# Altium project PaneLED.PrjPCB
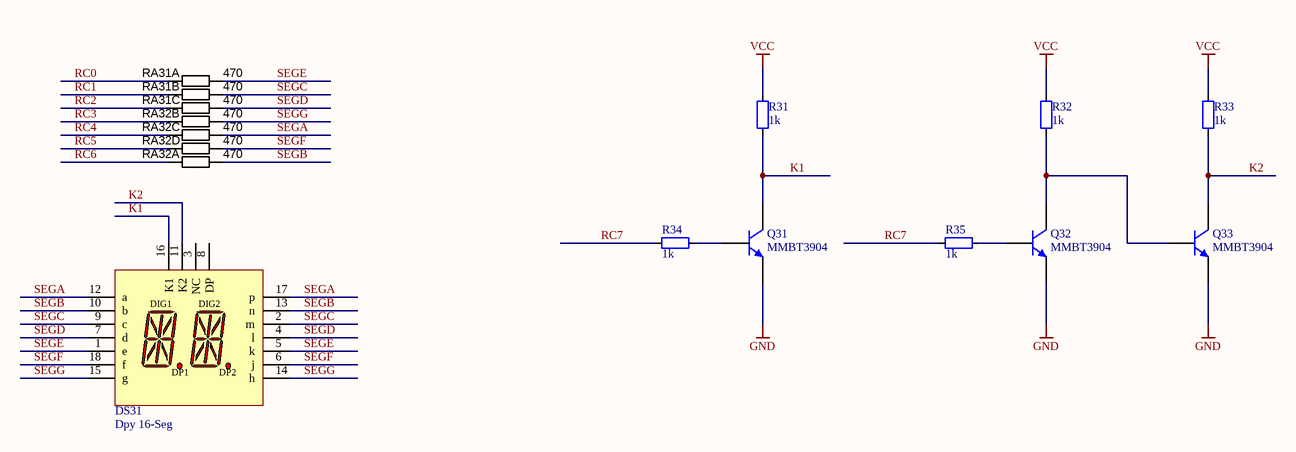
[diagram p0: 3 - display.SchDoc]
1 sheet, 11 parts. Net scope: global (net labels, ports and power ports of the same name join across sheets).
Board file: main.PcbDoc

## Sheet 3 - display.SchDoc
size A4

### Parts
DS31  Dpy 16-Seg  [HDSP-A2]
Q31  MMBT3904  [SOT23_N]
Q32  MMBT3904  [SOT23_N]
Q33  MMBT3904  [SOT23_N]
R31  value 1k  [RES_0603]  (hidden comment: Res_0603)
R32  value 1k  [RES_0603]  (hidden comment: Res_0603)
R33  value 1k  [RES_0603]  (hidden comment: Res_0603)
R34  value 1k  [RES_0603]  (hidden comment: Res_0603)
R35  value 1k  [RES_0603]  (hidden comment: Res_0603)
RA31  value 470  [RESCAXS50P160X320X70-8N]  (hidden comment: Film Res Pack)  (parts A,B,C of 4)
RA32  value 470  [RESCAXS50P160X320X70-8N]  (hidden comment: Film Res Pack)  (parts A,B,C,D of 4)

### Nets
GND: Q31.2(E) Q32.2(E) Q33.2(E)
VCC: R31.2 R32.2 R33.2
K1: DS31.16(K1) Q31.3(C) R31.1
K2: DS31.11(K2) Q33.3(C) R33.1
RC0: RA31.1
RC1: RA31.2
RC2: RA31.3
RC3: RA32.2
RC4: RA32.3
RC5: RA32.4
RC6: RA32.1
RC7: R34.2 R35.2
SEGA: DS31.12(a) DS31.17(p) RA32.6
SEGB: DS31.10(b) DS31.13(n) RA32.8
SEGC: DS31.2(m) DS31.9(c) RA31.7
SEGD: DS31.4(l) DS31.7(d) RA31.6
SEGE: DS31.1(e) DS31.5(k) RA31.8
SEGF: DS31.6(j) DS31.18(f) RA32.5
SEGG: DS31.14(h) DS31.15(g) RA32.7
NetQ31_1: Q31.1(B) R34.1
NetQ32_1: Q32.1(B) R35.1
NetQ32_3: Q32.3(C) Q33.1(B) R32.1

Not connected (* = marked no-connect by the designer): DS31 3(NC) 8(DP)

### Notes on the sheet
- (in symbol Dpy 16-Seg) DIG1; DIG2; DP1; DP2

### Library data of the parts
DS31 = Dpy 16-Seg: 13.7 mm Gray Surface As AlInGaP Red Alphanumeric Display: 2-Character, CC; Published: 8-Jun-2000; LatestRevisionDate: 17-Dec-2003; LatestRevisionNote: Schematic revised, PCB Footprint replaced.; DatasheetVersion: 20-Nov-2001; PackageVersion: 20-Nov-2001; PackageReference: HDSP-A2; Publisher: Altium Limited; PackageDescription: LED, Alphanumeric Display, 13.8 mm, Dual Character; 18 Leads; Row Space 15.24 mm; Pitch 2.54 mm; Colour: As AlInGaP Red; ComponentLink1Description: Manufacturer Link; ComponentLink1URL: http://www.agilent.com/
Q31-Q33 = MMBT3904: NPN Switching Transistor; Published: 17-Sep-2003; LatestRevisionDate: 12-Dec-2006; LatestRevisionNote: IPC-7351 Footprint Added.; DatasheetVersion: 13-May-2002; PackageVersion: May-1999; PackageReference: SOT23; Publisher: Altium Limited; PackageDescription: 3-Pin SOT-23 Package 0.95 mm Pitch, 2.3 mm Lead Span; ComponentLink1Description: Manufacturer Link; ComponentLink1URL: http://www.semiconductors.philips.com/; ComponentLink2Description: Datasheet; ComponentLink2URL: http://www.semiconductors.philips.com/acrobat/datasheets/MMBT3904_4.pdf; Supplier Part Number 1: MMBT3904FSCT-ND; Supplier 1: Digi-Key
R31-R35 = Res_0603: Resistor
RA31 RA32 = RESPACK_1K_5%_4X: Resistor array 1K Ohm 4-pack 62.5mW 5% 4x1608 SMD; Manufacturer 1: Yageo; Manufacturer Part Number 1: YC164-JR-071KL; Ratings: 1/16 W; Number of Resistors: 4; Circuit Type: Isolated; SCDType: source; Package / Case: 1206 (3216 Metric), Convex; Tolerance: ±5%; Number of Pins: 8; Power Per Element: 62.5mW; Mounting Type: Surface Mount; Supplier Device Package: 4 x 0603; Operating Temperature: -55°C ~ 155°C; ComponentLink1URL: http://www.yageo.com/documents/recent/PYu-YC_TC164_51_RoHS_L_3.pdf; ComponentLink1Description: http://www.yageo.com/documents/recent/PYu-YC_TC164_51_RoHS_L_3.pdf; Supplier 1: Digi-Key; Supplier Part Number 1: YC164J-1.0KCT-ND; Supplier 2: Digi-Key; Supplier Part Number 2: CRA6S81.0KCT-ND; Manufacturer 2: Vishay Dale; Manufacturer Part Number 2: CRA06S0831K00JTA; ComponentLink2URL: http://www.vishay.com/doc?31002; ComponentLink2Description: http://www.vishay.com/doc?31002; Supplier 3: Digi-Key; Supplier Part Number 3: RAVF164DJT1K00CT-ND; Manufacturer 3: Stackpole Electronics Inc; Manufacturer Part Number 3: RAVF164DJT1K00; RoHS 3: RoHS Compliant; Size / Dimension: 0.126" L x 0.063" W (3.20mm x 1.60mm); ComponentLink3URL: http://www.seielect.com/Catalog/SEI-RAVF.pdf; ComponentLink3Description: http://www.seielect.com/Catalog/SEI-RAVF.pdf; Supplier 4: Digi-Key; Supplier Part Number 4: Y9102CT-ND; Manufacturer 4: Panasonic Electronic Components; Manufacturer Part Number 4: EXB-38V102JV; RoHS 4: RoHS Compliant; ComponentLink4URL: http://industrial.panasonic.com/www-cgi/jvcr13pz.cgi?E+PZ+3+AOC0001+EXB38V102JV+7+WW; ComponentLink4Description: http://industrial.panasonic.com/www-cgi/jvcr13pz.cgi?E+PZ+3+AOC0001+EXB38V102JV+7+WW; Manufacturer Part Number 5: 4D03WGJ0102T5E; Manufacturer 5: Royal Ohm